# EAGLE design teensy-board (EAGLE 7.6.0)
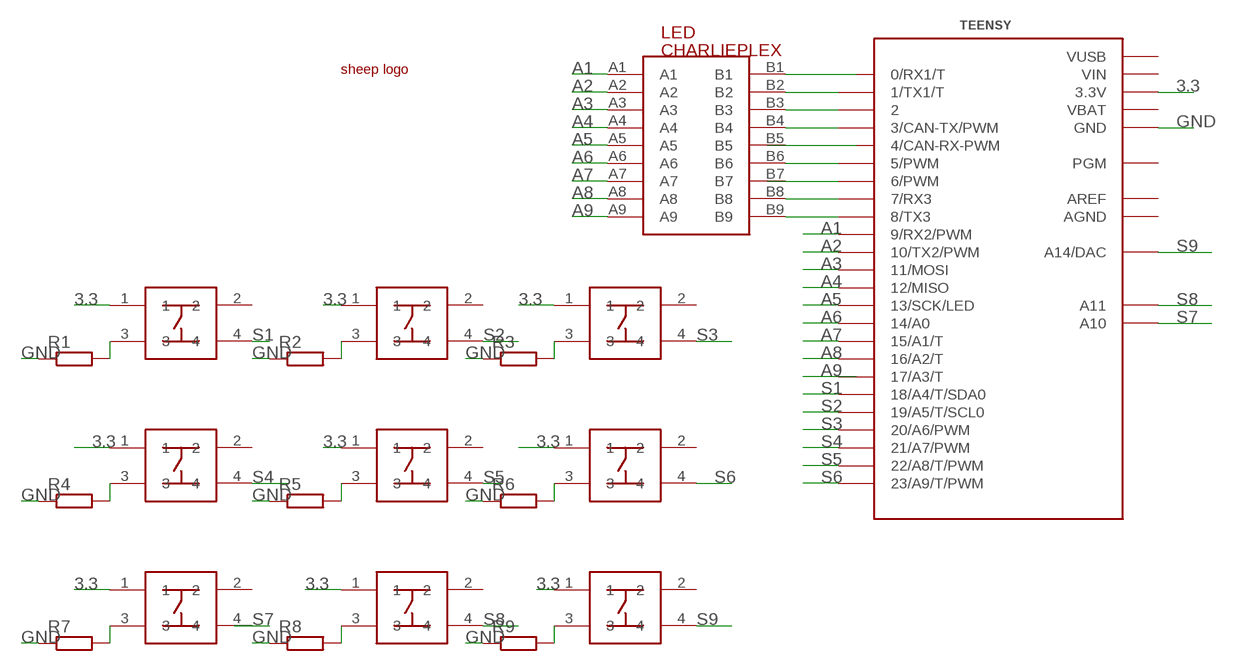
[diagram p0: schematic, sheet 1]

## Parts
1  PUSHBUTTON  [PUSHBUTTON]
2  PUSHBUTTON  [PUSHBUTTON]
3  PUSHBUTTON  [PUSHBUTTON]
4  PUSHBUTTON  [PUSHBUTTON]
5  PUSHBUTTON  [PUSHBUTTON]
6  PUSHBUTTON  [PUSHBUTTON]
7  PUSHBUTTON  [PUSHBUTTON]
8  PUSHBUTTON  [PUSHBUTTON]
9  PUSHBUTTON  [PUSHBUTTON]
LED  CHARLIEPLEX  [CHARLIEPLEXED]
R1  R-EU_0207/10  [0207/10]
R2  R-EU_0207/10  [0207/10]
R3  R-EU_0207/10  [0207/10]
R4  R-EU_0207/10  [0207/10]
R5  R-EU_0207/10  [0207/10]
R6  R-EU_0207/10  [0207/10]
R7  R-EU_0207/10  [0207/10]
R8  R-EU_0207/10  [0207/10]
R9  R-EU_0207/10  [0207/10]
TEENSY  TEENSY_3.1_ALL_PINS  [TEENSY3-ALL_PINS]
U$7  LOGO  [LOGO]

## Nets
3.3: 1.1 2.1 3.1 4.1 5.1 6.1 7.1 8.1 9.1 TEENSY.3.3V TEENSY.3.3V1(3.3V)
A1: LED.A1 TEENSY.9(9/RX2/PWM)
A2: LED.A2 TEENSY.10(10/TX2/PWM)
A3: LED.A3 TEENSY.11(11/MOSI)
A4: LED.A4 TEENSY.12(12/MISO)
A5: LED.A5 TEENSY.13(13/SCK/LED)
A6: LED.A6 TEENSY.14/A0
A7: LED.A7 TEENSY.15/A1(15/A1/T)
A8: LED.A8 TEENSY.16/A2(16/A2/T)
A9: LED.A9
GND: R1.1 R2.1 R3.1 R4.1 R5.1 R6.1 R7.1 R8.1 R9.1 TEENSY.GND TEENSY.GND1(GND)
N$1: LED.B1
N$2: LED.B2 TEENSY.1(1/TX1/T)
N$3: LED.B3 TEENSY.2
N$4: LED.B4 TEENSY.3(3/CAN-TX/PWM)
N$6: LED.B6 TEENSY.5(5/PWM)
N$7: TEENSY.6(6/PWM)
N$8: LED.B8 TEENSY.7(7/RX3)
N$9: LED.B9 TEENSY.8(8/TX3)
N$11: 1.3 R1.2
N$15: 2.3 R2.2
N$18: 3.3 R3.2
N$23: 4.3 R4.2
N$27: 5.3 R5.2
N$30: 6.3 R6.2
N$34: 7.3 R7.2
N$39: 8.3 R8.2
N$43: 9.3 R9.2
S1: 1.4 TEENSY.18/A4(18/A4/T/SDA0)
S2: 2.4 TEENSY.19/A5(19/A5/T/SCL0)
S3: 3.4 TEENSY.20/A6(20/A6/PWM)
S4: 4.4 TEENSY.21/A7(21/A7/PWM)
S5: 5.4 TEENSY.22/A8(22/A8/T/PWM)
S6: 6.4 TEENSY.23/A9(23/A9/T/PWM)
S7: TEENSY.A10
S8: 8.4 TEENSY.A11
S9: 9.4 TEENSY.RESET/DAC(A14/DAC)
Unconnected: 1.2 2.2 3.2 4.2 5.2 6.2 7.2 7.4 8.2 9.2 LED.B5 LED.B7 TEENSY.0(0/RX1/T) TEENSY.4(4/CAN-RX-PWM) TEENSY.17/A3(17/A3/T) TEENSY.PGM

## Power pins joined to a net without a drawn wire
AGND: TEENSY.AGND
AREF: TEENSY.AREF
VBAT: TEENSY.VBAT
VIN: TEENSY.VIN
VUSB: TEENSY.VUSB

## Library data of the parts
1-9 = adafruit_charlieplex_and_pushbutton:PUSHBUTTON: sc203 pushbutton push button switch
LED = adafruit_charlieplex_and_pushbutton:CHARLIEPLEX: Adafruit 9x16 16x9 led matrix charlieplexed
R1-R9 = resistor:R-EU_: RESISTOR, European symbol
TEENSY = Teensy_3_and_LC_Series_Boards_v1.1:TEENSY_3.1_ALL_PINS: Footprint for Teensy 3.1 or 3.2 board using all through-holes, i.e. the entire perimeter plus the 4 through-holes inboard (A10,A11,AREF, VUSB)
U$7 = adafruit_charlieplex_and_pushbutton:LOGO: sheep logo

## Board
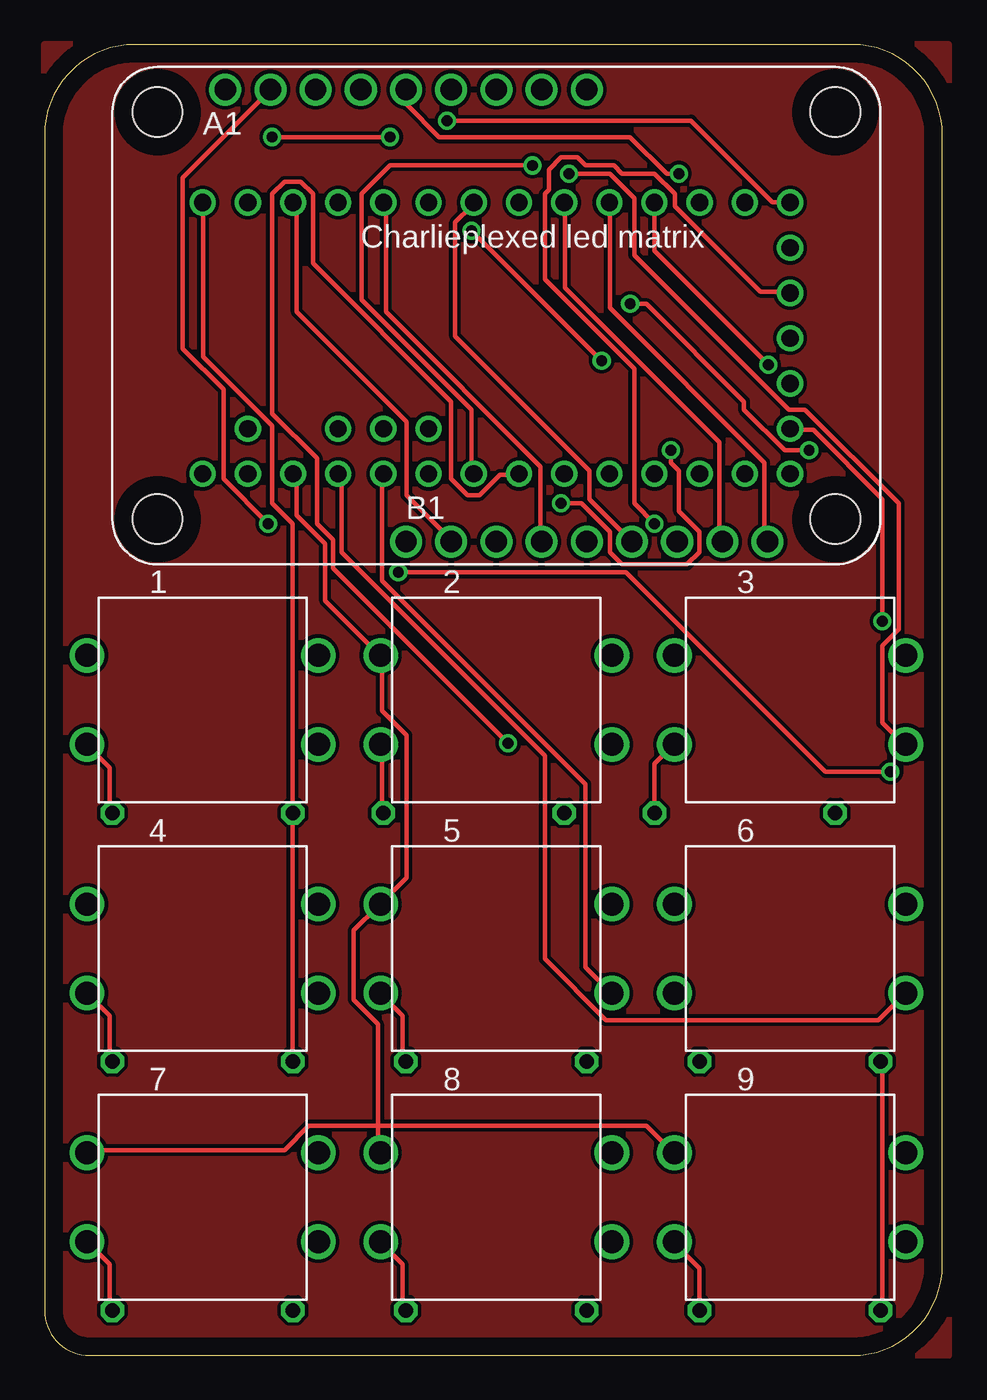
[diagram p1: board, top side]
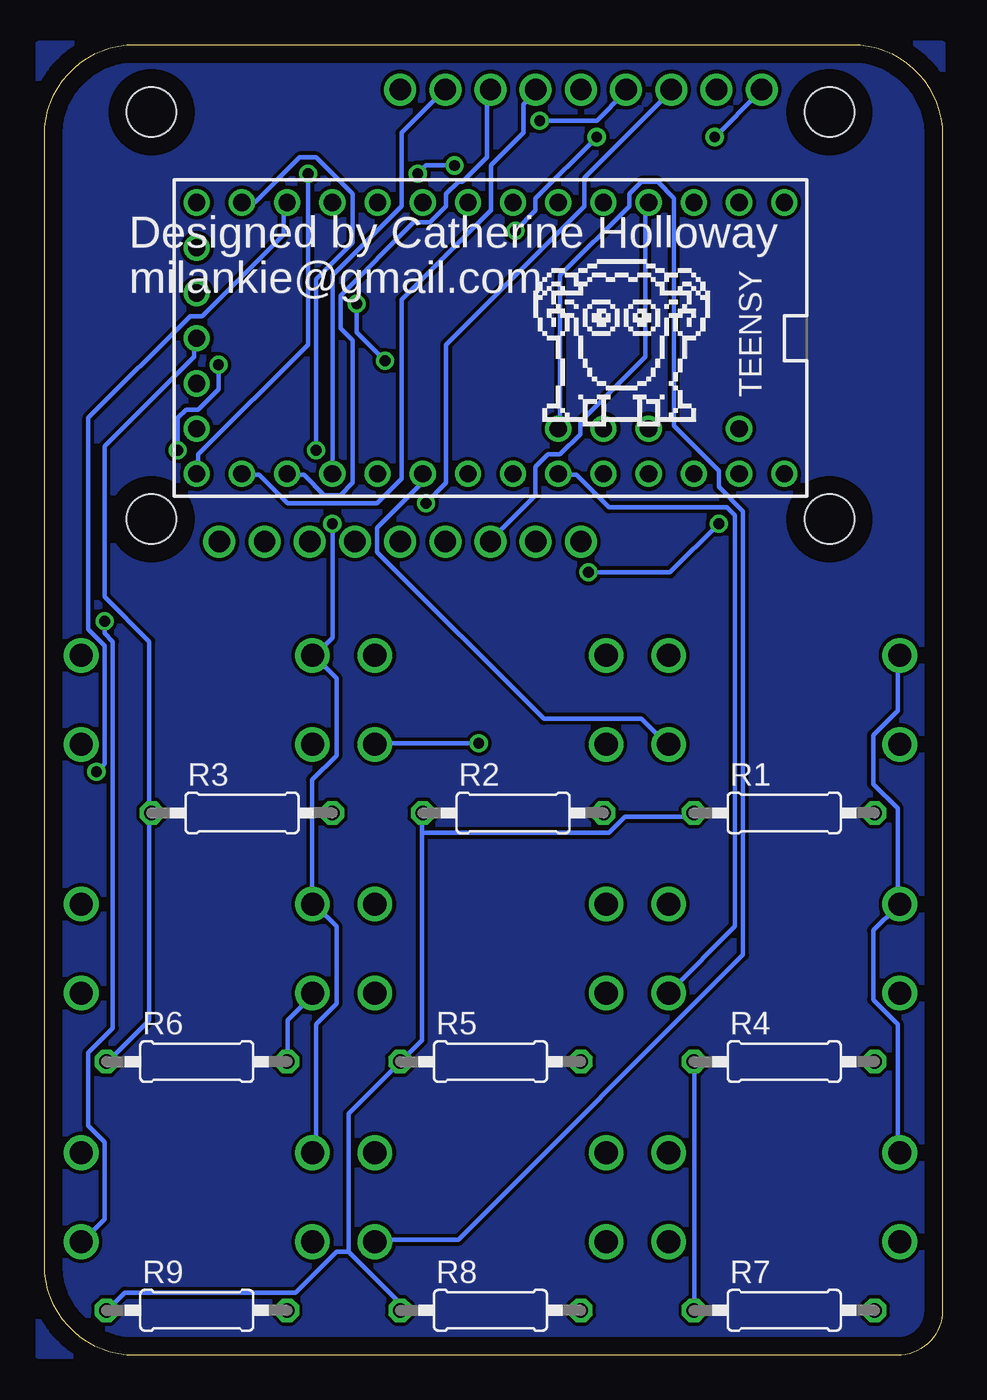
[diagram p2: board, bottom side, seen from below]

Size 50.47 x 73.65 mm. Coordinates in mm from the lower left corner, seen from the top.
Outline: 2.54,0 45.39,0 arc90 50.47,5.08 50.47,68.57 arc90 45.39,73.65 5.08,73.65 arc90 0,68.57 0,2.54 arc90 2.54,0
Copper layers (1*16): Top 0.035mm / dielectric 1.5mm / Bottom 0.035mm
Design rules "default": minimum track width 10mil, minimum drill 24mil, track to track 8mil, track to pad 8mil, pad to pad 8mil, via to via 8mil, smd to smd 8mil, copper to edge 40mil, drill to drill 8mil, minimum pad ring 10mil, minimum via ring 8mil, stop-mask expansion 4mil, vias tented up to drill 0mil, thermal gap 10mil

### Footprints (pad centres in the part's own frame; a part is rotated, then mirrored left to right if it is on the bottom)
PUSHBUTTON = drill 1.3: 1 -6.5,2.5; 2 6.5,2.5; 3 -6.5,-2.5; 4 6.5,-2.5
CHARLIEPLEXED = drill 1.2: A1 -12.7,-15.24; A2 -12.7,-12.7; A3 -12.7,-10.16; A4 -12.7,-7.62; A5 -12.7,-5.08; A6 -12.7,-2.54; A7 -12.7,0; A8 -12.7,2.54; A9 -12.7,5.08; B1 12.7,-5.08; B2 12.7,-2.54; B3 12.7,0; B4 12.7,2.54; B5 12.7,5.08; B6 12.7,7.62; B7 12.7,10.16; B8 12.7,12.7; B9 12.7,15.24 | hole 2.8: -11.43,19.05; 11.43,19.05; -11.43,-19.05; 11.43,-19.05
0207/10 = drill 0.813 octagon: 1 -5.08,0; 2 5.08,0
TEENSY3-ALL_PINS = drill 0.965: 0 -7.62,13.97; 1 -7.62,11.43; 2 -7.62,8.89; 3 -7.62,6.35; 3.3V 7.62,11.43; 3.3V1 -2.54,-16.51; 4 -7.62,3.81; 5 -7.62,1.27; 6 -7.62,-1.27; 7 -7.62,-3.81; 8 -7.62,-6.35; 9 -7.62,-8.89; 10 -7.62,-11.43; 11 -7.62,-13.97; 12 -7.62,-16.51; 13 7.62,-16.51; 14/A0 7.62,-13.97; 15/A1 7.62,-11.43; 16/A2 7.62,-8.89; 17/A3 7.62,-6.35; 18/A4 7.62,-3.81; 19/A5 7.62,-1.27; 20/A6 7.62,1.27; 21/A7 7.62,3.81; 22/A8 7.62,6.35; 23/A9 7.62,8.89; A10 5.08,6.35; A11 5.08,3.81; AGND 7.62,13.97; AREF 5.08,8.89; GND -7.62,16.51; GND1 0,-16.51; PGM 2.54,-16.51; RESET/DAC 5.08,-16.51; VBAT -5.08,-16.51; VIN 7.62,16.51; VUSB 5.08,13.97

### Placement (x,y rotation side)
1  8.89,36.83 0 top
2  25.4,36.83 0 top
3  41.91,36.83 0 top
4  8.89,22.86 0 top
5  25.4,22.86 0 top
6  41.91,22.86 0 top
7  8.89,8.89 0 top
8  25.4,8.89 0 top
9  41.91,8.89 0 top
E$1  [LOGO]  20.32,52.07 0 top
LED  25.4,58.42 270 top
R1  8.89,30.48 0 bottom
R2  24.13,30.48 0 bottom
R3  39.37,30.48 0 bottom
R4  8.89,16.51 0 bottom
R5  25.4,16.51 0 bottom
R6  41.91,16.51 0 bottom
R7  8.89,2.54 0 bottom
R8  25.4,2.54 0 bottom
R9  41.91,2.54 0 bottom
TEENSY  TEENSY_3.1_ALL_PINS  [TEENSY3-ALL_PINS]  25.4,57.15 270 bottom

### Tracks (layer width: path | path; a pad name or v marks a point on that pad's centre or on a via)
3.3  (via drill 0.61)
  Top 0.254: TEENSY.3.3V 14.17,49.48 14.17,47.19 15.77,45.59 15.77,42.39 18.75,39.42 2.1 18.97,39.19 18.97,36.22 20.34,34.85 20.34,26.85 18.97,25.48 5.1 18.75,25.25 17.37,23.88 17.37,19.99 18.75,18.62 18.75,12.9 | 18.75,12.9 18.75,11.53 8.1 | 18.75,12.9 14.86,12.9 13.49,11.53 2.52,11.53 7.1 | v34.29,46.74 33.15,47.88 33.15,55.42 28.12,60.45 28.12,65.25 28.35,65.48 28.35,66.62 29.03,67.31 29.95,67.31 30.4,66.85 32,66.85 32.46,66.4 34.29,66.4 35.43,65.25 35.43,64.57 40.23,59.77 41.83,59.77 TEENSY.3.3V1 | 18.75,12.9 33.83,12.9 35.2,11.53 9.1
  Bottom 0.254: 7.1 2.52,11.53 2.52,18.62 3.89,19.99 3.89,23.88 2.52,25.25 4.1 2.52,25.48 2.52,30.73 3.89,32.11 3.89,34.85 2.52,36.22 2.52,39.19 1.1 | 9.1 35.2,11.53 35.2,18.62 34.06,19.76 34.06,24.11 35.2,25.25 6.1 35.43,25.48 35.43,32.33 34.06,33.71 34.06,38.05 35.2,39.19 3.1 35.2,39.42 34.29,40.33 v34.29,46.74
A1  (via drill 0.61)
  Top 0.254: TEENSY.9 34.29,62.05 v40.69,55.65 | v42.98,50.85 41.6,50.85 39.32,53.14 39.32,53.59 33.83,59.08 v32.92,59.08 | v24,63.2 v31.32,55.88 | v12.8,68.45 v19.43,68.45
  Bottom 0.254: v40.69,55.65 40.69,54.28 41.83,53.14 42.52,53.14 42.98,52.68 v42.98,50.85 | v32.92,59.08 32.92,57.48 v31.32,55.88 | v24,63.2 22.86,64.34 22.86,65.02 v19.43,68.45 | v12.8,68.45 10.29,70.97 LED.A1
A2  (via drill 0.61)
  Top 0.254: v47.55,32.79 43.89,32.79 32.69,43.99 v19.89,43.99 | v12.57,46.74 10.06,49.25 10.06,54.28 7.77,56.57 7.77,66.17 12.57,70.97 LED.A2
  Bottom 0.254: v47.55,32.79 47.09,33.25 47.09,39.88 48.01,40.79 48.01,52.68 42.29,58.39 41.6,58.39 37.03,62.97 37.03,64.57 TEENSY.10 | v19.89,43.99 15.32,43.99 v12.57,46.74
A3  (via drill 0.61)
  Top 0.254: v35.2,50.85 35.2,50.16 35.66,49.71 35.66,47.42 36.8,46.28 36.8,45.14 36.12,44.45 32.46,44.45 31.77,45.14 31.77,46.28 30.18,47.88 v29.03,47.88
  Bottom 0.254: v35.2,50.85 35.2,60.45 33.15,62.51 33.15,65.25 35.2,67.31 36.12,67.31 38.63,64.8 39.32,64.8 TEENSY.11 | v29.03,47.88 27.89,49.02 27.89,56.79 20.12,64.57 20.12,66.17 15.32,70.97 LED.A3
A4  (via drill 0.61)
  Top 0.254: v22.63,69.37 36.35,69.37 40.92,64.8 41.83,64.8 TEENSY.12
  Bottom 0.254: v22.63,69.37 19.43,69.37 17.83,70.97 LED.A4
A5  (via drill 0.61)
  Top 0.254: v35.66,66.4 34.98,66.4 32.92,68.45 22.17,68.45 20.34,70.28 20.34,70.97 LED.A5
  Bottom 0.254: v35.66,66.4 35.66,56.79 41.83,50.62 41.83,49.71 TEENSY.13
A6
  Bottom 0.254: TEENSY.14/A0 39.32,49.48 38.41,49.48 36.8,47.88 31.77,47.88 30.4,49.25 30.4,59.31 25.38,64.34 25.38,66.85 23.55,68.68 23.55,70.28 22.86,70.97 LED.A6
A7
  Bottom 0.254: TEENSY.15/A1 36.8,49.48 35.89,49.48 34.75,48.34 33.83,48.34 33.15,49.02 33.15,57.02 33.83,57.71 33.83,59.54 29.72,63.65 28.8,63.65 27.89,64.57 27.89,65.25 27.2,65.94 26.98,65.94 25.6,67.31 25.6,70.97 LED.A7
A8
  Bottom 0.254: TEENSY.16/A2 34.29,60.68 30.4,64.57 30.4,68.68 28.12,70.97 LED.A8
GND
  Top 0.254: R4.1 13.95,16.56 13.95,30.28 R1.1 13.95,30.5 13.95,46.74 12.8,47.88 12.8,52.22 8.91,56.11 8.91,64.57 TEENSY.GND | R9.1 47.09,2.62 47.09,16.33 R6.1
  Bottom 0.254: R7.1 13.95,2.62 13.95,16.33 R4.1 | 33.38,5.82 30.63,3.07 30.63,2.62 R8.1 | 33.38,5.82 33.38,13.59 30.63,16.33 R5.1 30.4,16.56 29.26,17.7 29.26,29.36 | 29.26,29.36 29.26,30.28 R2.1 | R6.1 46.86,16.56 44.58,18.85 44.58,30.28 R3.1 44.58,30.5 44.58,40.11 47.09,42.62 47.09,51.08 42.06,56.11 42.06,57.02 TEENSY.GND1 | 33.38,5.82 34.06,5.82 36.35,3.53 45.95,3.53 46.86,2.62 R9.1 | 29.26,29.36 18.75,29.36 17.83,30.28 14.17,30.28 R1.1
N$2
  Top 0.254: TEENSY.1 14.17,64.57 14.17,58.62 20.34,52.45 20.34,48.34 22.86,45.82 LED.B2
N$3
  Bottom 0.254: TEENSY.2 16.69,64.57 16.69,56.11 20.34,52.45 20.34,51.76 21.49,50.62 22.17,50.62 22.86,49.94 22.86,48.34 25.38,45.82 LED.B3
N$4
  Top 0.254: TEENSY.3 19.2,64.57 19.2,58.62 27.89,49.94 27.89,45.82 LED.B4
N$5
  pour Bottom: 0,73.66 50.8,73.66 50.8,0 0,0
N$6
  Top 0.254: LED.B6 30.63,48.11 30.63,49.71 23.09,57.25 23.09,63.65 24,64.57 TEENSY.5
N$8
  Top 0.254: TEENSY.7 29.26,64.57 29.26,59.99 37.95,51.31 37.95,45.82 LED.B8
N$9
  Top 0.254: TEENSY.8 31.77,64.57 31.77,58.85 40.46,50.16 40.46,45.82 LED.B9
N$10
  pour Top: 0,73.66 50.8,73.66 50.8,0 0,0
N$11
  Top 0.254: R1.2 3.66,30.5 3.66,33.02 2.52,34.16 1.3
N$15
  Top 0.254: R2.2 18.97,30.5 18.97,34.16 2.3
N$18
  Top 0.254: R3.2 34.29,33.25 35.2,34.16 3.3
N$23
  Top 0.254: R4.2 3.66,16.56 3.66,19.07 2.52,20.22 4.3
N$27
  Top 0.254: R5.2 20.12,16.56 20.12,19.07 18.97,20.22 5.3
N$30
  Bottom 0.254: R6.2 36.8,16.56 36.8,18.85 35.43,20.22 6.3
N$34
  Top 0.254: R7.2 3.66,2.62 3.66,5.13 2.52,6.27 7.3
N$39
  Top 0.254: R8.2 20.12,2.62 20.12,5.13 18.97,6.27 8.3
N$43
  Top 0.254: R9.2 36.8,2.62 36.8,4.9 35.43,6.27 9.3
S1
  Bottom 0.254: TEENSY.18/A4 29.26,49.48 29.26,49.02 31.77,46.51 31.77,45.14 22.4,35.76 16.92,35.76 15.54,34.39 1.4
S2  (via drill 0.61)
  Top 0.254: v26.06,34.39 16.23,44.22 16.23,45.82 15.32,46.74 15.32,50.39 12.8,52.91 12.8,65.25 13.49,65.94 14.4,65.94 15.09,65.25 15.09,61.37 22.86,53.59 22.86,49.25 23.77,48.34 24.46,48.34 25.6,49.48 26.52,49.48 TEENSY.19/A5
  Bottom 0.254: v26.06,34.39 31.77,34.39 2.4
S3  (via drill 0.61)
  Top 0.254: v27.43,66.85 19.43,66.85 17.83,65.25 17.83,59.31 24,53.14 24,49.71 TEENSY.20/A6 | v29.49,66.4 31.77,66.4 33.15,65.02 33.15,61.82 41.83,53.14 42.75,53.14 48.01,47.88 48.01,40.79 47.09,39.88 47.09,35.53 48.23,34.39 3.4
  Bottom 0.254: v27.43,66.85 29.03,66.85 v29.49,66.4
S4
  Bottom 0.254: TEENSY.21/A7 21.49,49.48 20.57,49.48 18.75,47.65 12.12,47.65 11.66,47.19 11.66,24.11 15.32,20.45 4.4
S5
  Top 0.254: TEENSY.22/A8 18.97,49.48 18.97,43.54 30.4,32.11 30.4,21.82 31.77,20.45 5.4
S6
  Top 0.254: TEENSY.23/A9 16.69,49.48 16.69,45.14 28.12,33.71 28.12,22.28 31.55,18.85 46.86,18.85 48.23,20.22 6.4
S8
  Bottom 0.254: TEENSY.A11 21.49,52.22 21.49,60.68 17.6,64.57 17.6,65.25 16.92,65.94 16,65.94 15.09,65.02 15.09,52.22 12.57,49.71 12.57,48.79 11.2,47.42 11.2,22.5 27.2,6.5 31.77,6.5 8.4
S9  (via drill 0.61)
  Top 0.254: v47.09,41.25 47.09,48.11 43.2,51.99 42.06,51.99 TEENSY.RESET/DAC
  Bottom 0.254: v47.09,41.25 47.09,40.56 46.63,40.11 46.63,18.39 48.01,17.02 48.01,12.9 47.09,11.99 47.09,7.64 48.23,6.5 9.4

### Text on the board
bPlace: Designed by Catherine Holloway | milankie@gmail.com